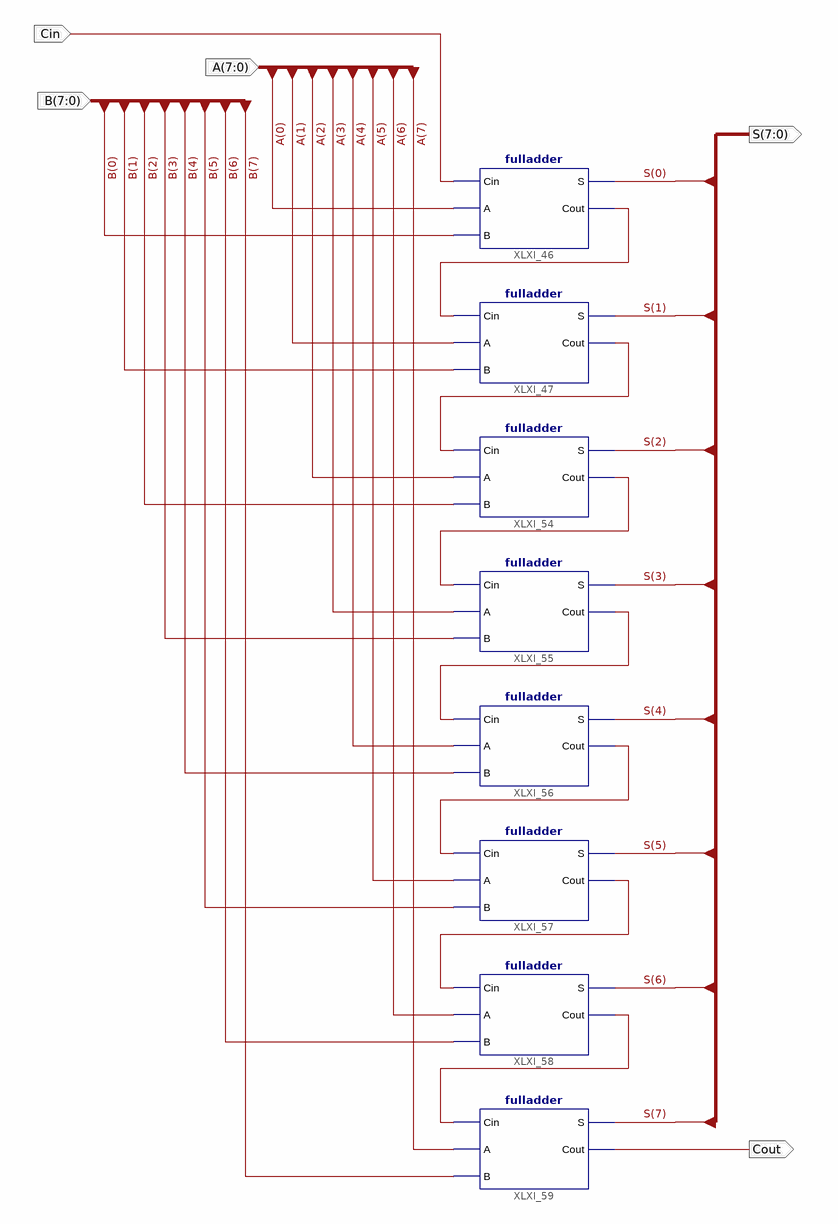
[diagram p0: schematic sheet 1]
// Xilinx ISE schematic adder8.sch (spartan6) as structural Verilog: 8 symbols, 5 ports
module adder8 (
  input  [7:0] B,
  input  [7:0] A,
  input  Cin,
  output Cout,
  output [7:0] S
);

  wire XLXN_51, XLXN_53, XLXN_55, XLXN_57, XLXN_59, XLXN_61, XLXN_63;

  fulladder XLXI_46 (.A(A[0]), .B(B[0]), .Cin(Cin), .Cout(XLXN_51), .S(S[0]));
  fulladder XLXI_47 (.A(A[1]), .B(B[1]), .Cin(XLXN_51), .Cout(XLXN_53), .S(S[1]));
  fulladder XLXI_54 (.A(A[2]), .B(B[2]), .Cin(XLXN_53), .Cout(XLXN_55), .S(S[2]));
  fulladder XLXI_55 (.A(A[3]), .B(B[3]), .Cin(XLXN_55), .Cout(XLXN_57), .S(S[3]));
  fulladder XLXI_56 (.A(A[4]), .B(B[4]), .Cin(XLXN_57), .Cout(XLXN_59), .S(S[4]));
  fulladder XLXI_57 (.A(A[5]), .B(B[5]), .Cin(XLXN_59), .Cout(XLXN_61), .S(S[5]));
  fulladder XLXI_58 (.A(A[6]), .B(B[6]), .Cin(XLXN_61), .Cout(XLXN_63), .S(S[6]));
  fulladder XLXI_59 (.A(A[7]), .B(B[7]), .Cin(XLXN_63), .Cout(Cout), .S(S[7]));
endmodule
